# EasyEDA Pro project 可调电源.eprj, board PCB8
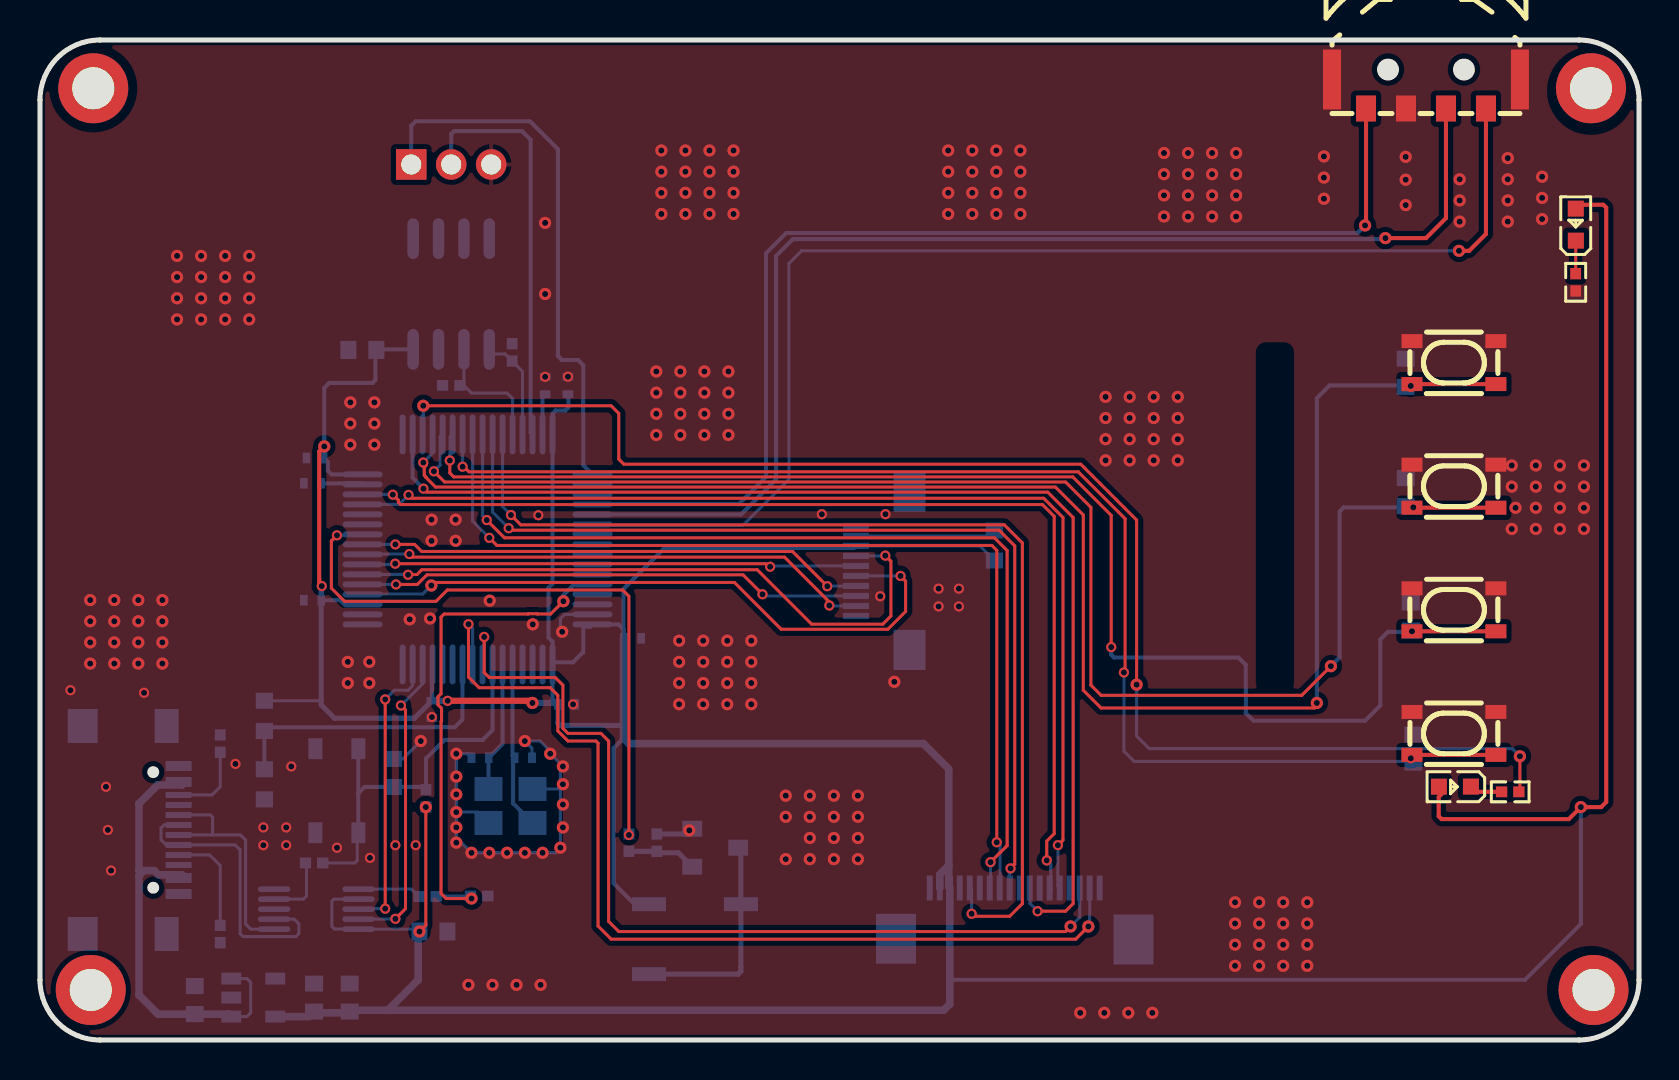
[diagram p4: board, top side]
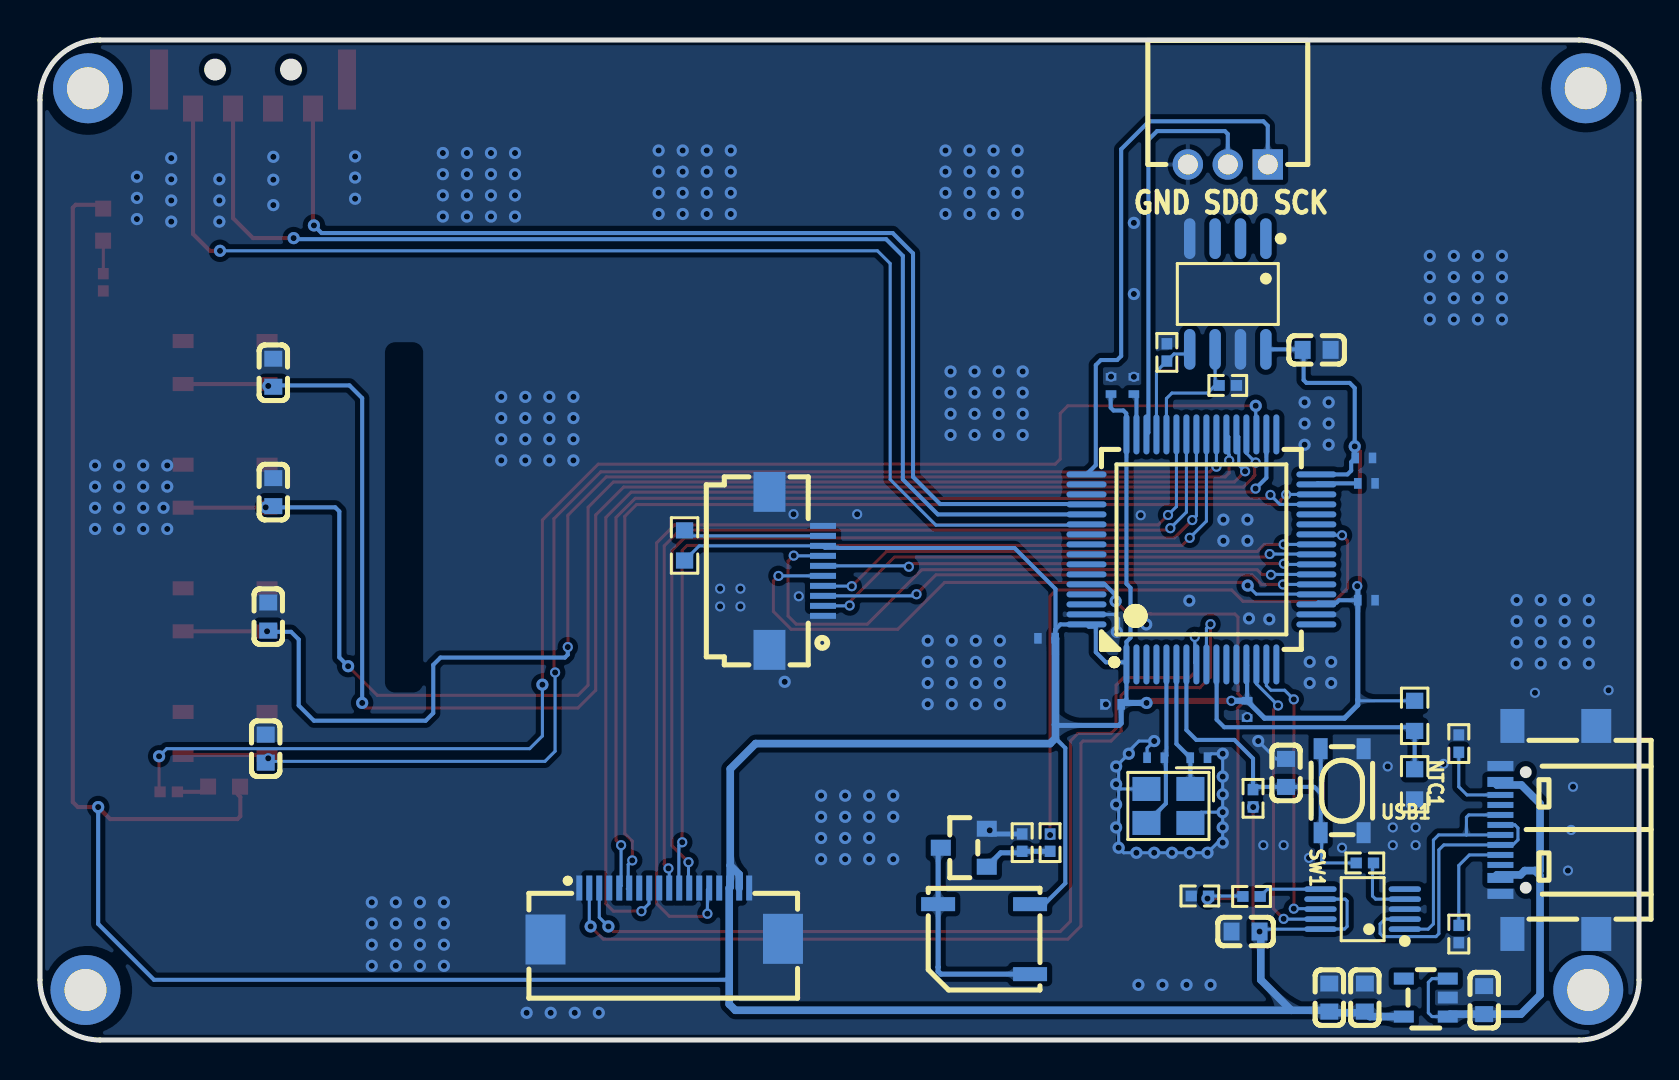
[diagram p5: board, bottom side, seen from below]

Outline 80 x 50 mm; copper layers: Top Layer, Bottom Layer. Coordinates in mm from the lower left corner of the outline.
Outline path: 0,47 0,3 arc(0.88,0.88) 3,0 77,0 arc(79.12,0.88) 80,3 80,47 arc(79.12,49.12) 77,50 3,50 arc(0.88,49.12) 0,47
Stack: Top Layer 0.035mm / Dielectric1 1.51mm FR4 er 4.5 / Bottom Layer 0.035mm

## Design rules (mm)
template: 自定义配置
spacing copperThickness1oz (default): track to track 0.102, other pairs 0.152 to 0.3
spacing copperThickness2oz: track to track 0.203, other pairs 0.152 to 0.3
track width copperThickness1oz (default): min 0.127, default 0.254, max 2.54
track width copperThickness2oz: min 0.203, default 0.254, max 2.54
differential pair differentialPair (default): width min 0.127, default 0.254, max 2.54; gap min 0.152, default 0.152
via viaSize (default): diameter min 0.5, default 0.61, max 10; hole min 0.3, default 0.305, max 6.3

## Placement (name value [footprint] x y rotation side)
BUZZER2  4kHz  [BUZ-SMD_L5.0-W5.5-P4.60]  32.77 5.04 0 bottom
C1  100nF  [C0603]  68.33 27.39 90 bottom
C5  100nF  [C0603]  17.66 13.35 90 bottom
C32  100nF  [C0402]  13.77 29.1 180 bottom
C33  100nF  [C0402]  13.64 21.99 180 bottom
C34  100nF  [C0402]  26.34 16.78 0 bottom
C35  100nF  [C0402]  19.61 16.53 270 bottom
C36  100nF  [C0402]  26.42 32.73 90 bottom
C37  100nF  [C0402]  29.64 20.08 0 bottom
C73  100nF  [C0603]  7.75 1.99 90 bottom
C74  1uF  [C0603]  15.49 2.12 90 bottom
C75  100nF  [C0603]  13.72 2.12 90 bottom
C242  2.2uF  [C0402]  13.64 27.83 180 bottom
C243  2.2uF  [C0402]  25.27 32.73 90 bottom
C244  100nF  [C0603]  68.71 14.57 90 bottom
C245  100nF  [C0603]  68.58 21.17 90 bottom
C246  100nF  [C0603]  68.33 33.36 90 bottom
C247  100nF  [C0603]  19.68 5.42 180 bottom
C250  100nF  [C0402]  22.02 14.12 0 bottom
C251  100nF  [C0402]  24.18 14.12 0 bottom
C253  100nF  [C0603]  16.13 34.51 0 bottom
FPC3  AFC01-S10FCA-00  [FPC-SMD_P0.5-10P_FGS-XJ-H2.0]  42.16 23.46 90 bottom
FPC4  FPC-05F-18PH20  [FPC-SMD_18P-P0.50_FPC-05F-18PH20]  48.77 6.31 180 bottom
LED1  -  [LED_0603]  76.83 40.82 90 top
LED2  -  [LED_0603]  70.74 12.66 180 top
NOREF  -  [Pad_e39]  2.54 2.5 270 top
NOREF#2  -  [Pad_e41]  77.72 2.5 270 top
NOREF#3  -  [Pad_e43]  77.6 47.59 270 top
NOREF#4  -  [Pad_e37]  2.67 47.59 270 top
NTC1  10K  [R0603]  11.23 12.78 90 bottom
Q14  -  [S8050_SOT-23]  33.78 9.49 180 bottom
R52  1K  [R0402]  29.46 9.87 270 bottom
R53  10K  [R0402]  30.86 9.87 270 bottom
R54  10K  [R0603]  11.23 16.21 90 bottom
R55  8R  [R0603]  47.75 24.73 90 bottom
R60  0R  [R0402]  13.72 8.85 180 bottom
R61  0R  [R0402]  19.39 7.18 180 bottom
R64  10K  [R0402]  19.31 12.08 90 bottom
R65  4.7K  [R0402]  21.97 7.2 180 bottom
R66  2K  [R0402]  76.83 37.89 90 top
R67  2K  [R0402]  73.56 12.41 180 top
R68  5.1K  [R0402]  9.02 14.82 270 bottom
R69  5.1K  [R0402]  9.02 5.3 90 bottom
R70  4.7K  [R0402]  23.62 34.38 90 bottom
R71  4.7K  [R0402]  20.57 32.73 180 bottom
STM32F405  STM32F405RGT6V  [LQFP-64_L10.0-W10.0-P0.50-LS12.0-BL]  21.89 24.53 180 bottom
SW1  SKRPACE010  [KEY-SMD_4P-L4.2-W3.2-P2.20-LS4.6]  14.85 12.46 270 bottom
SW2  SKRPACE010  [KEY-SMD_4P-L4.2-W3.2-P2.20-LS4.6]  70.74 15.33 0 top
SW3  SKRPACE010  [KEY-SMD_4P-L4.2-W3.2-P2.20-LS4.6]  70.74 21.51 0 top
SW4  SKRPACE010  [KEY-SMD_4P-L4.2-W3.2-P2.20-LS4.6]  70.74 33.87 0 top
SW5  SKRPACE010  [KEY-SMD_4P-L4.2-W3.2-P2.20-LS4.6]  70.74 27.69 0 top
SW9  TM-2024A  [SW-SMD_TM-2024A]  69.34 48.6 0 top
U11  TLV75733PDBVR  [SOT-23-5_L2.9-W1.6-P0.95-LS2.8-BL]  10.67 2.12 90 bottom
U12  CH340X  [MSOP-10_L3.0-W3.0-P0.50-LS5.0-BL]  13.83 6.54 90 bottom
U13  HC-PH-3AW-G  [CONN-TH_3P-P2.00_HC-PH-3AW-G]  20.57 43.78 0 bottom
U14  AT24C16  [SOP-8_L5.0-W4.0-P1.27-LS6.0-BL]  20.57 37.3 0 bottom
USB1  TYPE-C 16P QTWT  [USB-TYPE-C-SMD_TYPE-C-16P-QTWT]  4.44 10.5 90 bottom
X2  8MHz  [CRYSTAL-SMD_4P-L3.2-W2.5-BL]  23.54 11.7 0 bottom

## Footprints (pads in the part's own frame, mm; a bottom-side part is the same pattern mirrored in y, then rotated)
BUZ-SMD_L5.0-W5.5-P4.60
  rect 1.7x0.7 smd: 1(-2.3,-1.75) 2(2.3,-1.75) 3(-2.3,1.75)
C0402
  rect 0.381x0.533 smd: 1(-0.432,0) 2(0.432,0)
C0603
  rect 0.8x0.9 smd: 1(-0.7,0) 2(0.7,0)
CONN-TH_3P-P2.00_HC-PH-3AW-G
  rect 1.524x1.524 hole 1: 1(-2,0)
  round 1.524 hole 1: 2(0,0) 3(2,0)
CRYSTAL-SMD_4P-L3.2-W2.5-BL
  rect 1.4x1.2 smd: 1(-1.1,-0.85) 2(1.1,-0.85) 3(1.1,0.85) 4(-1.1,0.85)
FPC-SMD_18P-P0.50_FPC-05F-18PH20
  rect 0.3x1.25 smd: 1(-4.25,1.288) 2(-3.75,1.288) 3(-3.25,1.288) 4(-2.75,1.288) 5(-2.25,1.288) 6(-1.75,1.288) 7(-1.25,1.288) 8(-0.75,1.288) 9(-0.25,1.288) 10(0.25,1.288) 11(0.75,1.288) 12(1.25,1.288) 13(1.75,1.288) 14(2.25,1.288) 15(2.75,1.288) 16(3.25,1.288) 17(3.75,1.288) 18(4.25,1.288)
  rect 2x2.5 smd: 19(-5.94,-1.288) 20(5.94,-1.252)
FPC-SMD_P0.5-10P_FGS-XJ-H2.0
  rect 0.3x1.3 smd: 1(-2.25,-1.339) 2(-1.75,-1.339) 3(-1.25,-1.34) 4(-0.75,-1.339) 5(-0.25,-1.34) 6(0.25,-1.339) 7(0.75,-1.339) 8(1.25,-1.339) 9(1.75,-1.339) 10(2.25,-1.34)
  rect 2x1.6 smd: 11(3.95,1.34) 12(-3.95,1.34)
KEY-SMD_4P-L4.2-W3.2-P2.20-LS4.6
  rect 1.05x0.7 smd: 1(-2.1,1.075) 2(2.1,1.075) 3(-2.1,-1.075) 4(2.1,-1.075)
LED_0603
  rect 0.8x0.8 smd: 1(-0.851,-0.01) 2(0.75,-0.005)
LQFP-64_L10.0-W10.0-P0.50-LS12.0-BL
  oval 0.3x2 smd: 1(-3.75,-5.75) 2(-3.25,-5.75) 3(-2.75,-5.75) 4(-2.25,-5.75) 5(-1.75,-5.75) 6(-1.25,-5.75) 7(-0.75,-5.75) 8(-0.25,-5.75) 9(0.25,-5.75) 10(0.75,-5.75) 11(1.25,-5.75) 12(1.75,-5.75) 13(2.25,-5.75) 14(2.75,-5.75) 15(3.25,-5.75) 16(3.75,-5.75) 33(3.75,5.75) 34(3.25,5.75) 35(2.75,5.75) 36(2.25,5.75) 37(1.75,5.75) 38(1.25,5.75) 39(0.75,5.75) 40(0.25,5.75) 41(-0.25,5.75) 42(-0.75,5.75) 43(-1.25,5.75) 44(-1.75,5.75) 45(-2.25,5.75) 46(-2.75,5.75) 47(-3.25,5.75) 48(-3.75,5.75)
  oval 2x0.3 smd: 17(5.75,-3.75) 18(5.75,-3.25) 19(5.75,-2.75) 20(5.75,-2.25) 21(5.75,-1.75) 22(5.75,-1.25) 23(5.75,-0.75) 24(5.75,-0.25) 25(5.75,0.25) 26(5.75,0.75) 27(5.75,1.25) 28(5.75,1.75) 29(5.75,2.25) 30(5.75,2.75) 31(5.75,3.25) 32(5.75,3.75) 49(-5.75,3.75) 50(-5.75,3.25) 51(-5.75,2.75) 52(-5.75,2.25) 53(-5.75,1.75) 54(-5.75,1.25) 55(-5.75,0.75) 56(-5.75,0.25) 57(-5.75,-0.25) 58(-5.75,-0.75) 59(-5.75,-1.25) 60(-5.75,-1.75) 61(-5.75,-2.25) 62(-5.75,-2.75) 63(-5.75,-3.25) 64(-5.75,-3.75)
MSOP-10_L3.0-W3.0-P0.50-LS5.0-BL
  oval 0.28x1.62 smd: 1(-1,-2.11) 2(-0.5,-2.11) 3(0,-2.11) 4(0.5,-2.11) 5(1,-2.11) 6(1,2.11) 7(0.5,2.11) 8(0,2.11) 9(-0.5,2.11) 10(-1,2.11)
Pad_e37
  round 3.5 hole 2.1: 1(0,0)
Pad_e39
  round 3.5 hole 2.1: 1(0,0)
Pad_e41
  round 3.5 hole 2.1: 1(0,0)
Pad_e43
  round 3.5 hole 2.1: 1(0,0)
R0402
  rect 0.566x0.54 smd: 1(-0.433,0) 2(0.433,0)
R0603
  rect 0.806x0.864 smd: 1(-0.753,0) 2(0.753,0)
S8050_SOT-23
  rect 1x0.8 smd: 1(1.15,-0.823) 2(1.15,1.077) 3(-1.15,0.127)
SOP-8_L5.0-W4.0-P1.27-LS6.0-BL
  oval 0.574x2.035 smd: 1(-1.905,-2.768) 2(-0.635,-2.768) 3(0.635,-2.768) 4(1.905,-2.768) 5(1.905,2.768) 6(0.635,2.768) 7(-0.635,2.768) 8(-1.905,2.768)
SOT-23-5_L2.9-W1.6-P0.95-LS2.8-BL
  rect 0.6x1 smd: 1(-0.95,-1.1) 2(0,-1.1) 3(0.95,-1.1) 4(0.95,1.1) 5(-0.95,1.1)
SW-SMD_TM-2024A
  rect 1x1.3 smd: 1(-3,-2.03) 2(3,-2.03) 3(-1,-2.03) 4(1,-2.03)
  rect 0.9x3 smd: 5(-4.7,-0.58) 6(4.7,-0.58)
USB-TYPE-C-SMD_TYPE-C-16P-QTWT
  rect 1.7x1.5 smd: 0(-5.2,-2.309) 0(5.2,-2.309)
  rect 1.7x1.2 smd: 0(-5.2,1.891) 0(5.2,1.891)
  rect 0.5x1.3 smd: A1(-3.2,2.49) A4(-2.4,2.49) A9(2.4,2.49) A12(3.2,2.49)
  rect 0.3x1.3 smd: A5(-1.25,2.49) A6(-0.25,2.49) A7(0.25,2.49) A8(1.25,2.491) B5(1.75,2.49) B6(0.75,2.49) B7(-0.75,2.49) B8(-1.75,2.491)

## Nets
As in the schematic, except:
GND: C1.2 C5.2 C32.2 C33.2 C34.2 C35.2 C36.2 C37.2 C73.2 C74.2 C75.2 C242.2 C243.2 C244.2 C245.2 C246.2 C247.1 C250.1 C251.2 C253.1 FPC3.1 FPC3.10 FPC3.11 FPC3.12 FPC4.1 FPC4.4 FPC4.7 FPC4.9 FPC4.13 FPC4.15 FPC4.18 FPC4.19 FPC4.20 NTC1.1 Q14.2 R53.1 R65.1 R66.1 R68.1 R69.1 R70.2 R71.2 STM32F405.12 STM32F405.18 STM32F405.63 SW1.1 SW1.2 SW2.1 SW2.2 SW3.1 SW3.2 SW4.1 SW4.2 SW5.1 SW5.2 SW9.3 SW9.5 SW9.6 U11.2 U12.3 U13.3 U14.4 U14.7 USB1.0 USB1.A1 USB1.A12 X2.2 X2.4

Pads without a net: NOREF 1; NOREF#2 1; NOREF#3 1; NOREF#4 1; STM32F405 4 11 16 17 33 50 51 55 56 57 58 59 61 62; U11 4; U12 5; U14 1 2 3; USB1 A8 B8

## Via types
v1: diameter 0.61, hole 0.305, Top Layer to Bottom Layer, 262 vias
v2: diameter 0.508, hole 0.305, Top Layer to Bottom Layer, 69 vias

## Routing (per net, layer and track width the routed paths; a pad name or vN(x,y) marks a point on that pad's centre or on a via; arc(x,y) is an arc through that point)
3V3: length 269.9
  Top Layer w0.152: v1(19.3,11.65) 19.3,5.74 v1(18.98,5.42)
  Top Layer w0.203: v2(14.1,22.69) 13.97,22.82 13.97,29.43 v1(14.22,29.68) ; LED1.2 77.03,41.76 78.22,41.76 78.36,41.62 78.36,11.9 78.11,11.65 v1(77.09,11.65) 76.49,11.05 70.12,11.05 69.98,11.19 69.98,12.15 70.12,12.29
  Top Layer w0.305: v2(20.4,16.96) 24.53,16.96 v1(24.64,16.85)
  Bottom Layer w0.152: FPC3.8 47.02,24.71 R55.1 ; U12.7 14.7,7.04 14.6,6.95 14.6,5.68 14.73,5.55 15.93,5.55 U12.10 18.87,5.54 v1(18.98,5.42) ; v1(19.3,11.65) 19.31,11.65 ; 14.07,17.01 14.02,16.96 R54.2
  Bottom Layer w0.203: 25.84,16.85 25.64,17.05 STM32F405.1 ; STM32F405.32 14.59,28.28 14.4,28.47 14.4,28.9 C32.1 ; STM32F405.13 19.61,18.74 C35.1 ; 29.19,20.53 29.19,22.55 31.24,24.6 40.06,24.6 40.07,24.61 40.73,24.61 FPC3.8 ; 29.19,20.53 28.95,20.78 STM32F405.64 27.53,20.66 27.18,20.66 27.18,19.39 26.67,18.89 25.75,18.89 STM32F405.1 ; 29.19,20.53 29.19,20.07 ; 29.19,20.53 29.21,20.52 C37.1 ; C36.1 26.43,32.28 26.43,31.62 26.29,31.47 25.8,31.47 25.65,31.33 25.65,30.29 STM32F405.48 25.64,22.81 25.44,22.61 25.44,20.11 25.64,19.91 STM32F405.1 ; C33.1 15.01,21.99 15.13,21.88 16.05,21.88 STM32F405.19 ; BUZZER2.1 29.75,6.79 28.7,7.84 28.7,14.6 29.19,15.09 ; v1(14.22,29.68) 14.22,32.6 14.48,32.86 16.64,32.86 16.78,33 16.78,34.46 C253.2 16.85,34.53 U14.8 ; 45.52,3.08 45.59,3.01 74.3,3.01 77.09,5.8 v1(77.09,11.65)
  Bottom Layer w0.254: C32.1 14.22,29.13 v1(14.22,29.68) ; 29.19,15.77 29.15,15.73 26.02,15.73 25.91,15.84 25.91,16.78 ; C35.1 18.74,16.09 14.73,16.09 14.07,16.75 C33.1 14.07,22.67 v2(14.1,22.69)
  Bottom Layer w0.305: C34.1 25.84,16.85 v1(24.64,16.85) ; C35.1 v2(20.4,16.96)
  Bottom Layer w0.381: 17.4,1.49 18.92,3.01 18.92,5.36 v1(18.98,5.42) ; 17.4,1.49 45.21,1.49 45.52,1.79 FPC4.16 45.47,7.65 45.47,8.72 ; 17.4,1.49 15.56,1.49 15.43,1.36 13.78,1.36 C75.1 13.47,1.17 U11.5 ; 45.47,8.72 45.47,13.55 44.2,14.82 29.46,14.82 29.19,15.09 29.19,20.07 C37.1 ; 45.47,8.72 45.02,8.28 FPC4.17
+5V: length 23.6
  Bottom Layer w0.152: U11.1 10.35,1.17 10.54,1.36 10.54,2.88 10.35,3.07 U11.3
  Bottom Layer w0.381: 5.21,8.47 5.71,8.47 5.93,8.26 7.11,8.26 7.26,8.1 ; 5.21,8.47 4.95,8.22 4.95,2.25 5.91,1.29 C73.1 9.44,1.29 U11.1 ; 5.21,8.47 4.95,8.47 4.95,11.82 5.88,12.75 7.11,12.75 7.26,12.9
GND: length 27.8
  Bottom Layer w0.152: STM32F405.63 26.25,21.28 26.03,21.06 26.03,20.5 v1(26.13,20.41) ; v1(19.05,14.95) 18.16,14.05 C5.2 ; 26.03,12.66 v1(26.03,9.61) 25.78,9.36 v1(25.15,9.36) v1(24.26,9.36) v1(23.37,9.36) v1(22.48,9.36) v1(21.59,9.36) 20.83,10.12 v1(20.83,10.63) v1(20.83,11.39) ; 26.03,12.66 v1(26.16,12.79) ; 26.03,12.66 25.93,12.55 X2.2 ; 26.03,12.66 26.03,13.55 v1(26.16,13.68) v1(25.53,14.31) 25.53,14.44 25.02,14.95 v1(24.26,14.95) 24.61,14.59 C251.2 ; v1(20.83,11.39) v1(20.83,12.28) v1(20.83,13.17) v1(20.83,14.31) 21.39,14.31 C250.1 ; v1(20.83,11.39) 21.9,11.39 X2.4
  Bottom Layer w0.254: R53.1 32.37,10.3 Q14.2
  vias: v1(2.51,22) v1(2.51,20.94) v1(2.51,19.88) v1(2.51,18.82) v1(3.72,22) v1(3.72,20.94) v1(3.72,19.88) v1(3.72,18.82) v1(4.92,22) v1(4.92,20.94) v1(4.92,19.88) v1(4.92,18.82) v1(6.12,22) v1(6.12,20.94) v1(6.12,19.88) v1(6.12,18.82) v1(6.86,39.2) v1(6.86,38.15) v1(6.86,37.09) v1(6.86,36.03) v1(8.06,39.2) v1(8.06,38.15) v1(8.06,37.09) v1(8.06,36.03) v1(9.26,39.2) v1(9.26,38.15) v1(9.26,37.09) v1(9.26,36.03) v1(10.47,39.2) v1(10.47,38.15) v1(10.47,37.09) v1(10.47,36.03) v1(15.4,18.91) v1(15.4,17.85) v1(15.53,31.88) v1(15.53,30.82) v1(15.53,29.76) v1(16.48,18.91) v1(16.48,17.85) v1(16.73,31.88) v1(16.73,30.82) v1(16.73,29.76) v1(18.5,21.03) v1(19.51,21.08) v1(19.59,26.02) v1(19.59,24.96) v1(20.79,26.02) v1(20.79,24.96) v1(20.83,9.87) v1(21.44,2.76) v1(22.5,21.97) v1(22.64,2.76) v1(23.84,2.76) v1(24.65,20.78) v1(25.05,2.76) v1(25.27,40.86) v1(25.27,37.3) v1(26.16,11.77) v1(26.16,10.63) v1(30.83,33.43) v1(30.83,32.37) v1(30.83,31.31) v1(30.83,30.25) v1(31.09,44.48) v1(31.09,43.42) v1(31.09,42.36) v1(31.09,41.3) v1(31.98,19.96) v1(31.98,18.91) v1(31.98,17.85) v1(31.98,16.79) v1(32.04,33.43) v1(32.04,32.37) v1(32.04,31.31) v1(32.04,30.25) v1(32.29,44.48) v1(32.29,43.42) v1(32.29,42.36) v1(32.29,41.3) v1(32.48,10.48) v1(33.24,33.43) v1(33.24,32.37) v1(33.24,31.31) v1(33.24,30.25) v1(33.18,19.96) v1(33.18,18.91) v1(33.18,17.85) v1(33.18,16.79) v1(33.49,44.48) v1(33.49,43.42) v1(33.49,42.36) v1(33.49,41.3) v1(34.44,33.43) v1(34.44,32.37) v1(34.44,31.31) v1(34.44,30.25) v1(34.38,19.96) v1(34.38,18.91) v1(34.38,17.85) v1(34.38,16.79) v1(34.7,44.48) v1(34.7,43.42) v1(34.7,42.36) v1(34.7,41.3) v1(35.59,19.96) v1(35.59,18.91) v1(35.59,17.85) v1(35.59,16.79) v1(37.31,12.22) v1(37.31,11.16) v1(37.31,9.04) v1(38.51,12.22) v1(38.51,11.16) v1(38.51,10.1) v1(38.51,9.04) v1(39.72,12.22) v1(39.72,11.16) v1(39.72,10.1) v1(39.72,9.04) v1(40.92,12.22) v1(40.92,11.16) v1(40.92,10.1) v1(40.92,9.04) v1(42.74,17.91) v1(45.44,44.48) v1(45.44,43.42) v1(45.44,42.36) v1(45.44,41.3) v1(46.64,44.48) v1(46.64,43.42) v1(46.64,42.36) v1(46.64,41.3) v1(47.85,44.48) v1(47.85,43.42) v1(47.85,42.36) v1(47.85,41.3) v1(49.05,44.48) v1(49.05,43.42) v1(49.05,42.36) v1(49.05,41.3) v1(52.04,1.36) v1(53.25,1.36) v1(53.31,32.16) v1(53.31,31.1) v1(53.31,30.04) v1(53.31,28.98) v1(54.45,1.36) v1(54.52,32.16) v1(54.52,31.1) v1(54.52,30.04) v1(54.52,28.98) v1(55.65,1.36) v1(55.72,32.16) v1(55.72,31.1) v1(55.72,30.04) v1(55.72,28.98) v1(56.23,44.35) v1(56.23,43.29) v1(56.23,42.23) v1(56.23,41.17) v1(56.92,32.16) v1(56.92,31.1) v1(56.92,30.04) v1(56.92,28.98) v1(57.44,44.35) v1(57.44,43.29) v1(57.44,42.23) v1(57.44,41.17) v1(58.64,44.35) v1(58.64,43.29) v1(58.64,42.23) v1(58.64,41.17) v1(59.84,44.35) v1(59.84,43.29) v1(59.84,42.23) v1(59.84,41.17) v1(59.79,6.88) v1(59.79,5.83) v1(59.79,4.77) v1(59.79,3.71) v1(60.99,6.88) v1(60.99,5.83) v1(60.99,4.77) v1(60.99,3.71) v1(62.2,6.88) v1(62.2,5.83) v1(62.2,4.77) v1(62.2,3.71) v1(63.4,6.88) v1(63.4,5.83) v1(63.4,4.77) v1(63.4,3.71) v1(64.23,44.18) v1(64.23,43.12) v1(64.23,42.06) v1(68.33,44.16) v1(68.33,43.02) v1(68.33,41.75) v1(71.03,43.04) v1(71.03,41.98) v1(71.03,40.92) v1(73.43,44.09) v1(73.43,43.04) v1(73.43,41.98) v1(73.43,40.92) v1(73.63,28.73) v1(73.63,27.67) v1(73.63,25.55) v1(73.82,26.61) v1(74.84,28.73) v1(74.84,27.67) v1(74.84,26.61) v1(74.84,25.55) v1(75.15,43.16) v1(75.15,42.11) v1(75.15,41.05) v1(76.04,28.73) v1(76.04,27.67) v1(76.04,26.61) v1(76.04,25.55) v1(77.24,28.73) v1(77.24,27.67) v1(77.24,26.61) v1(77.24,25.55) v2(1.52,17.49) v2(3.3,12.66) v2(3.4,10.5) v2(3.56,8.47) v2(5.21,17.36) v2(9.78,13.81) v2(11.18,10.63) v2(11.18,9.74) v2(12.32,10.63) v2(12.32,9.74) v2(12.57,13.68) v2(14.86,9.61) v2(16.51,9.11) v2(17.78,9.74) v2(18.8,9.74) v2(19.61,16.15) v2(24.93,26.24) v2(25.27,33.16) v2(26.42,33.17) v2(26.67,16.78) v2(39.12,26.29) v2(42.04,22.19) v2(42.3,26.29) v2(44.96,22.57) v2(44.96,21.68) v2(45.97,22.57) v2(45.97,21.68)
AT_SCL: length 6.3
  Bottom Layer w0.152: U14.6 21.21,32.73 21.59,32.35 23.37,32.35 23.64,32.07 STM32F405.44
AT_SDA: length 5.3
  Bottom Layer w0.152: STM32F405.45 24.14,33.42 R70.1 23.27,34.3 22.68,34.3 22.48,34.51 U14.5
BOOT0: length 25.9
  Top Layer w0.152: v1(21.59,7.07) 20.32,7.07 20.07,7.33 20.07,15.92 20.09,15.95 20.09,16.58 19.91,16.76 19.91,17.16 20.07,17.31 20.07,21.15 20.22,21.3 24.42,21.3 24.43,21.31 24.87,21.31 24.89,21.3 25.55,21.3 v1(26.19,21.94)
  Bottom Layer w0.152: R61.1 19.84,7.2 R65.2
  Bottom Layer w0.203: R65.2 21.54,7.13 v1(21.59,7.07) ; v1(26.19,21.94) 26.19,22.24 26.72,22.78 STM32F405.60
BUZZER: length 31.6
  Top Layer w0.152: v2(29.46,10.25) 29.46,22.19 29.15,22.5 20.38,22.5 19.81,21.93 15.24,21.93 14.58,22.59 14.58,24.95 v2(14.86,25.23)
  Bottom Layer w0.152: v2(29.46,10.25) R52.1 ; v2(14.86,25.23) 16.1,25.23 STM32F405.26
FAN: length 52.6
  Top Layer w0.152: v2(23.56,26.25) 24.06,25.76 48.25,25.76 49.15,24.85 49.15,6.82 48.51,6.19 46.74,6.19 v2(46.61,6.31)
  Bottom Layer w0.152: FPC4.14 46.61,7.51 v2(46.61,6.31) ; v2(23.56,26.25) 23.14,26.67 STM32F405.43
INA_SCL: length 54.2
  Top Layer w0.152: v2(18.44,27.25) 18.61,27.09 50.22,27.09 51.18,26.12 51.18,10 v2(50.93,9.74)
  Bottom Layer w0.152: 50.92,7.71 50.93,7.71 v2(50.93,9.74) ; STM32F405.29 17.97,26.78 v2(18.44,27.25)
INA_SDA: length 54
  Top Layer w0.152: v2(17.65,27.27) 17.93,26.99 17.93,26.88 18.04,26.77 50.15,26.77 50.74,26.18 50.74,10.32 50.37,9.94 v2(50.37,8.98)
  Bottom Layer w0.152: STM32F405.30 17.64,27.28 v2(17.65,27.27) ; 50.61,7.55 50.57,7.6 50.57,8.78 v2(50.37,8.98)
K1: length 81.5
  Top Layer w0.152: v2(19.18,28.87) 19.3,28.75 19.3,28.71 19.23,28.63 19.23,28.23 19.3,28.16 19.3,28.13 19.79,27.65 50.8,27.65 52.2,26.25 52.2,17.49 53.09,16.6 63.75,16.6 63.88,16.73
  Top Layer w0.203: SW4.4 68.67,32.8 v1(68.58,32.7)
  Bottom Layer w0.152: v2(19.18,28.87) 19.64,29.34 STM32F405.36
  Bottom Layer w0.203: v1(63.88,16.85) 63.88,32.09 64.52,32.73 68.55,32.73 v1(68.58,32.7)
K2: length 73.2
  Top Layer w0.152: v2(19.71,28.43) 20.24,27.9 51.31,27.9 52.58,26.63 52.58,17.74 53.09,17.23 63.13,17.23 v1(64.58,18.69)
  Top Layer w0.203: SW5.4 SW5.3
  Bottom Layer w0.152: STM32F405.37 20.02,30.16 20.02,28.75 v2(19.71,28.43)
  Bottom Layer w0.203: v1(68.71,26.63) 65.23,26.63 65.02,26.43 65.02,19.13 v1(64.58,18.69)
K3: length 68.7
  Top Layer w0.152: v2(20.5,28.98) 20.5,28.35 20.7,28.16 51.67,28.16 53.59,26.23 v2(53.59,19.65)
  Top Layer w0.203: SW3.4 v1(68.64,20.43)
  Bottom Layer w0.152: STM32F405.38 20.52,30.16 20.52,29.27 20.5,29.25 v2(20.5,28.98)
  Bottom Layer w0.203: C245.1 68.52,20.41 67.44,20.41 67.06,20.03 67.06,16.73 66.29,15.96 60.71,15.96 60.33,16.34 60.33,18.76 59.96,19.12 53.74,19.12 53.59,19.27 v2(53.59,19.65)
K4: length 66.3
  Top Layer w0.152: v2(21.14,28.66) 21.21,28.66 21.46,28.41 51.94,28.41 54.29,26.07 54.29,18.44 v2(54.23,18.38)
  Top Layer w0.203: SW2.4 SW2.3
  Bottom Layer w0.152: v2(54.23,18.38) 54.23,14.44 54.74,13.93 68.43,13.93 v2(68.58,14.08) ; STM32F405.39 v2(21.14,28.66)
KEY_LEFT: length 56.7
  Top Layer w0.203: 66.34,46.45 66.34,40.78 v1(66.29,40.73)
  Bottom Layer w0.203: v1(66.29,40.73) 65.91,40.35 37.34,40.35 36.32,39.33 36.32,28.16 34.96,26.8 27.66,26.8 STM32F405.52
KEY_PUSH: length 60.7
  Top Layer w0.203: v1(67.31,40.09) 69.34,40.09 70.34,41.09 70.34,46.45
  Bottom Layer w0.203: STM32F405.53 35.08,26.28 36.83,28.03 36.83,39.2 37.67,40.04 67.26,40.04 v1(67.31,40.09)
KEY_RIGHT: length 63.2
  Top Layer w0.203: 72.34,46.45 72.34,40.3 71.5,39.46 v1(70.99,39.46)
  Bottom Layer w0.152: v1(70.99,39.46) 38.1,39.46 37.46,38.82 37.46,28.03 35.18,25.74 27.68,25.74 STM32F405.54
LCD_CS: length 32.9
  Top Layer w0.152: v2(43.05,23.2) 43.31,22.95 43.31,21.42 42.42,20.54 37.08,20.54 34.74,22.88 19.73,22.88 v1(19.58,22.72)
  Bottom Layer w0.152: STM32F405.20 16.16,22.3 19.15,22.3 v1(19.58,22.72) ; FPC3.5 43.05,23.21 v2(43.05,23.2)
LCD_DC: length 25.6
  Top Layer w0.152: v2(39.39,22.69) 37.65,24.43 19.1,24.43 18.74,24.78 v2(17.78,24.78)
  Bottom Layer w0.152: STM32F405.25 v2(17.78,24.78) ; v2(39.39,22.69) 39.39,22.69 40.81,22.69 FPC3.4
LCD_MISO: length 32.4
  Top Layer w0.152: v2(18.42,23.26) 18.43,23.27 18.86,23.27 19.1,23.51 35.89,23.51 38.61,20.79 42.16,20.79 42.57,21.2 42.57,23.94 v2(42.29,24.22)
  Bottom Layer w0.152: v2(42.29,24.22) 42.28,24.21 FPC3.7 ; STM32F405.22 18.39,23.28 v2(18.42,23.26)
LCD_MOSI: length 24.8
  Top Layer w0.152: v2(17.77,23.81) 36.3,23.81 36.45,23.66 v2(36.53,23.66)
  Bottom Layer w0.152: FPC3.6 36.57,23.71 v2(36.53,23.66) ; STM32F405.23 17.74,23.78 v2(17.77,23.81)
LCD_RST: length 25.9
  Top Layer w0.152: v2(39.49,21.72) 39.49,21.9 37.25,24.14 18.63,24.14 v2(18.48,24.3)
  Bottom Layer w0.152: v2(18.48,24.3) 16.16,24.3 STM32F405.24 ; v2(39.49,21.72) 39.51,21.71 FPC3.2
LCD_SCL: length 25.3
  Top Layer w0.152: v2(36.15,22.29) 35.18,23.26 19.36,23.26 18.88,22.78 v2(17.81,22.78)
  Bottom Layer w0.152: STM32F405.21 17.81,22.78 v2(17.81,22.78) ; v2(36.15,22.29) 36.23,22.21 FPC3.3
LED: length 72.8
  Top Layer w0.152: v1(54.86,17.77) 54.86,26 52.07,28.79 29.21,28.79 28.96,29.05 28.96,31.33 28.58,31.71 v1(19.18,31.71) ; 74.04,12.62 v1(74.04,14.19)
  Bottom Layer w0.152: v1(19.18,31.71) 19.18,30.31 STM32F405.35 ; v1(54.86,17.77) 54.86,15.2 55.5,14.57 73.66,14.57 v1(74.04,14.19)
NRST: length 19.7
  Bottom Layer w0.152: R60.1 15.75,8.85 15.88,8.98 15.88,10.31 15.93,10.36
  Bottom Layer w0.203: 15.92,12.34 15.92,10.37 15.93,10.36 ; 15.92,12.34 15.92,14.56 15.93,14.56 ; 15.92,12.34 16.24,12.65 C5.1 19.17,12.65 19.31,12.52 19.31,14.07 20.24,15 22.15,15 22.64,15.5 STM32F405.7
NTC_ADC: length 14.8
  Bottom Layer w0.203: STM32F405.10 21.13,18.77 21.13,16.02 20.75,15.64 11.41,15.64 R54.1 NTC1.2
OSC_IN: length 8.4
  Bottom Layer w0.203: X2.3 23.67,11.83 23.67,14.04 C251.1 23.64,14.22 STM32F405.5
OSC_OUT: length 6.5
  Bottom Layer w0.203: X2.1 22.44,14.12 C250.2 23.14,14.81 STM32F405.6
RELEASE: length 58.6
  Top Layer w0.152: v2(19.19,27.57) 19.36,27.39 50.42,27.39 51.69,26.12 51.69,6.82 51.31,6.44 v2(49.91,6.44)
  Bottom Layer w0.152: v2(49.91,6.44) 49.53,6.82 49.53,7.07 49.52,7.09 FPC4.8
  Bottom Layer w0.203: STM32F405.34 18.64,28.11 v2(19.19,27.57)
RXD: length 15.3
  Top Layer w0.152: v2(18.06,16.73) 18.29,16.5 18.29,6.57 v2(17.78,6.06)
  Bottom Layer w0.152: STM32F405.14 19.14,17.81 v2(18.06,16.73) ; U12.9 17.76,6.04 v2(17.78,6.06)
SC_CE: length 49.8
  Top Layer w0.152: v2(21.44,20.79) 21.44,18.15 21.97,17.61 25.53,17.61 25.91,17.23 25.91,15.46 26.42,14.95 27.81,14.95 27.92,14.84 27.92,5.7 28.58,5.04 51.82,5.04 v1(52.45,5.68)
  Bottom Layer w0.152: FPC4.2 52.52,5.74 v1(52.45,5.68) ; v2(21.44,20.79) 21.64,20.58 STM32F405.9
SC_INT: length 47.9
  Top Layer w0.152: v2(23.45,25.59) 23.55,25.49 47.98,25.49 48.77,24.71 48.77,8.79 v2(48.56,8.58)
  Bottom Layer w0.152: STM32F405.42 22.64,26.39 v2(23.45,25.59) ; v2(48.56,8.58) 48.52,8.54 FPC4.10
SC_PSTOP: length 46.7
  Top Layer w0.152: v1(51.56,5.68) 51.31,5.42 28.96,5.42 28.45,5.93 28.45,14.95 28.07,15.33 26.42,15.33 26.16,15.58 26.16,17.74 25.78,18.12 22.48,18.12 22.23,18.38 v2(22.23,20.16)
  Bottom Layer w0.152: STM32F405.8 22.23,18.86 v2(22.23,20.16) ; FPC4.3 52.02,6.13 v1(51.56,5.68)
SC_SCL: length 48.3
  Top Layer w0.152: v2(47.55,8.89) 48.03,9.37 48.04,9.37 48.32,9.65 48.32,9.65 48.39,9.72 48.39,24.47 47.75,25.11 23.24,25.11 v2(22.35,26)
  Bottom Layer w0.152: STM32F405.41 22.14,26.21 v2(22.35,26) ; v2(47.55,8.89) 47.55,7.64 FPC4.12
SC_SDA: length 48.1
  Top Layer w0.152: v2(22.48,25.11) 22.86,24.73 47.62,24.73 47.87,24.48 v2(47.87,9.89)
  Bottom Layer w0.152: FPC4.11 48.04,7.62 48.04,9.72 v2(47.87,9.89) ; STM32F405.40 21.64,25.94 v2(22.48,25.11)
SWCLK: length 27.1
  Bottom Layer w0.203: 18.57,44.03 18.57,45.71 18.8,45.94 24.51,45.94 25.91,44.54 25.91,34.2 26.11,34 26.92,34 27.18,33.74 27.18,28.74 STM32F405.49
SWDIO/OSD_CS: length 20.3
  Bottom Layer w0.203: 20.57,44.03 20.57,45.3 20.72,45.44 24.11,45.44 24.55,45.01 24.55,30.38 STM32F405.46
TXD: length 14.5
  Top Layer w0.152: v2(17.27,17.03) v2(17.27,6.57)
  Bottom Layer w0.152: STM32F405.15 18.64,17.72 18.42,17.49 17.73,17.49 v2(17.27,17.03) ; v2(17.27,6.57) 15.96,6.57 U12.8
USB_N: length 15.1
  Bottom Layer w0.152: 7.26,10.75 7.13,10.75 7.13,10.76 6.21,10.76 6.06,10.6 6.06,10.01 6.31,9.75 USB1.B7 9.77,9.75 10.01,9.51 10.01,5.31 10.16,5.17 12.8,5.17 12.95,5.32 12.95,5.8 12.72,6.04 U12.2
USB_P: length 11
  Bottom Layer w0.152: 8.64,10.25 7.26,10.25 ; 8.64,10.25 10.03,10.25 10.29,10 10.29,5.8 10.55,5.54 U12.1 ; 8.64,10.25 8.64,11.14 8.52,11.25 7.44,11.25
$1N1881: length 3.5
  Bottom Layer w0.254: Q14.1 31.94,9.36 30.94,9.36 30.86,9.44 29.46,9.44
$1N1887: length 10.9
  Bottom Layer w0.254: Q14.3 35.07,9.48 BUZZER2.2 35.07,3.64 35.07,3.64 35.07,3.44 34.92,3.29 BUZZER2.3
$1N4544: length 2.1
  Bottom Layer w0.203: C242.1 16.09,27.83 STM32F405.31
$1N4570: length 2.1
  Bottom Layer w0.203: STM32F405.47 25.14,32.17 C243.1
$1N6033: length 7
  Bottom Layer w0.152: R55.2 47.48,25.21 FPC3.9
$1N7364: length 3.4
  Bottom Layer w0.152: R60.2 13.33,8.8 13.33,7.2 13.18,7.04 U12.4
$1N7403: length 3.2
  Bottom Layer w0.152: U12.6 18.59,7.54 R61.2
$1N10061: length 1.7
  Top Layer w0.152: R66.2 76.83,39.96 LED1.1
$1N10137: length 1.7
  Top Layer w0.203: R67.2 71.83,12.41 71.59,12.65 LED2.1
$1N15960: length 3.5
  Bottom Layer w0.152: R68.2 9.02,12.66 8.61,12.25 7.44,12.25
$1N15986: length 4.8
  Bottom Layer w0.152: 7.44,9.25 8.49,9.25 9.02,8.72 9.02,5.73

## Copper pours and planes (outline as drawn; the poured copper is in the pictures)
GND on Top Layer: -22.35,64.48 106.05,64.48 106.05,-28.99 -22.35,-28.99
GND on Bottom Layer: -9.65,59.78 112.65,59.78 112.65,-16.68 -9.65,-16.68

Small or netless copper shapes (teardrops, artwork), in the pictures only: 35 on Top Layer, 192 on Bottom Layer

## Text on the board
Bottom Silkscreen Layer: SCK | SDO | GND
